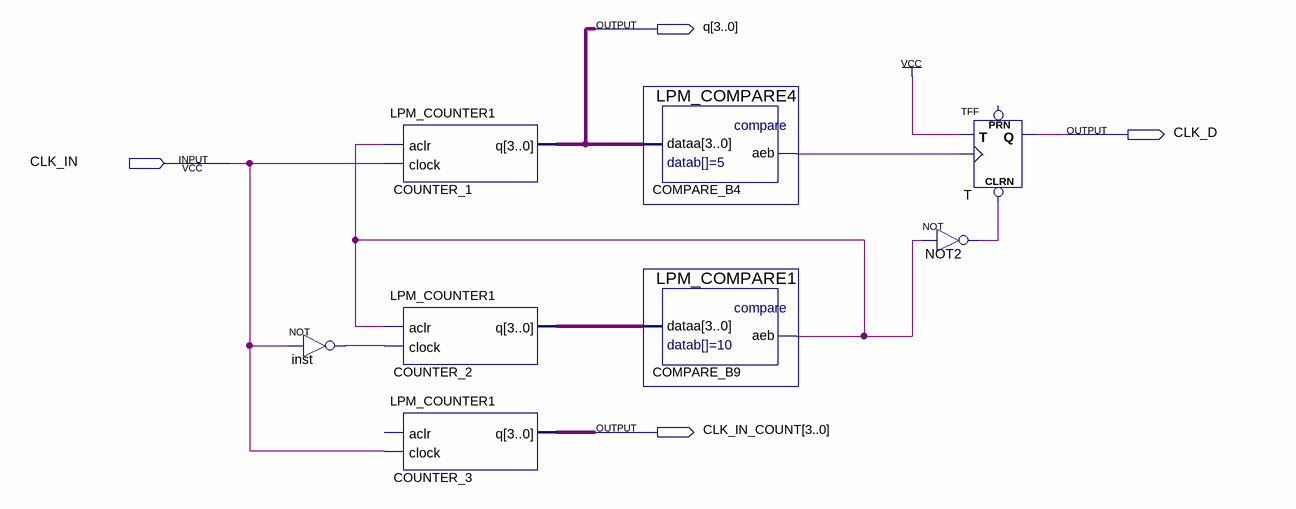
[diagram p0: schematic sheet]
// Quartus schematic Block_2_D.bdf as structural Verilog: 8 symbols, 4 pins
module Block_2_D (
  input  CLK_IN,
  output [3:0] q,
  output CLK_D,
  output [3:0] CLK_IN_COUNT
);

  wire COMPARE_B4_aeb, COMPARE_B9_aeb, inst_out, NOT2_out;
  wire [3:0] COUNTER_2_q;

  not inst (inst_out, CLK_IN);
  LPM_COUNTER1 COUNTER_1 (.aclr(COMPARE_B9_aeb), .clock(CLK_IN), .q(q));
  LPM_COUNTER1 COUNTER_2 (.aclr(COMPARE_B9_aeb), .clock(inst_out), .q(COUNTER_2_q));
  LPM_COUNTER1 COUNTER_3 (.clock(CLK_IN), .q(CLK_IN_COUNT));  // open: aclr
  LPM_COMPARE4 COMPARE_B4 (.dataa(q), .aeb(COMPARE_B4_aeb));
  LPM_COMPARE1 COMPARE_B9 (.dataa(COUNTER_2_q), .aeb(COMPARE_B9_aeb));
  not NOT2 (NOT2_out, COMPARE_B9_aeb);
  TFF T (.CLRN(NOT2_out), .T(1'b1), .CLK(COMPARE_B4_aeb), .Q(CLK_D));  // open: PRN
endmodule
